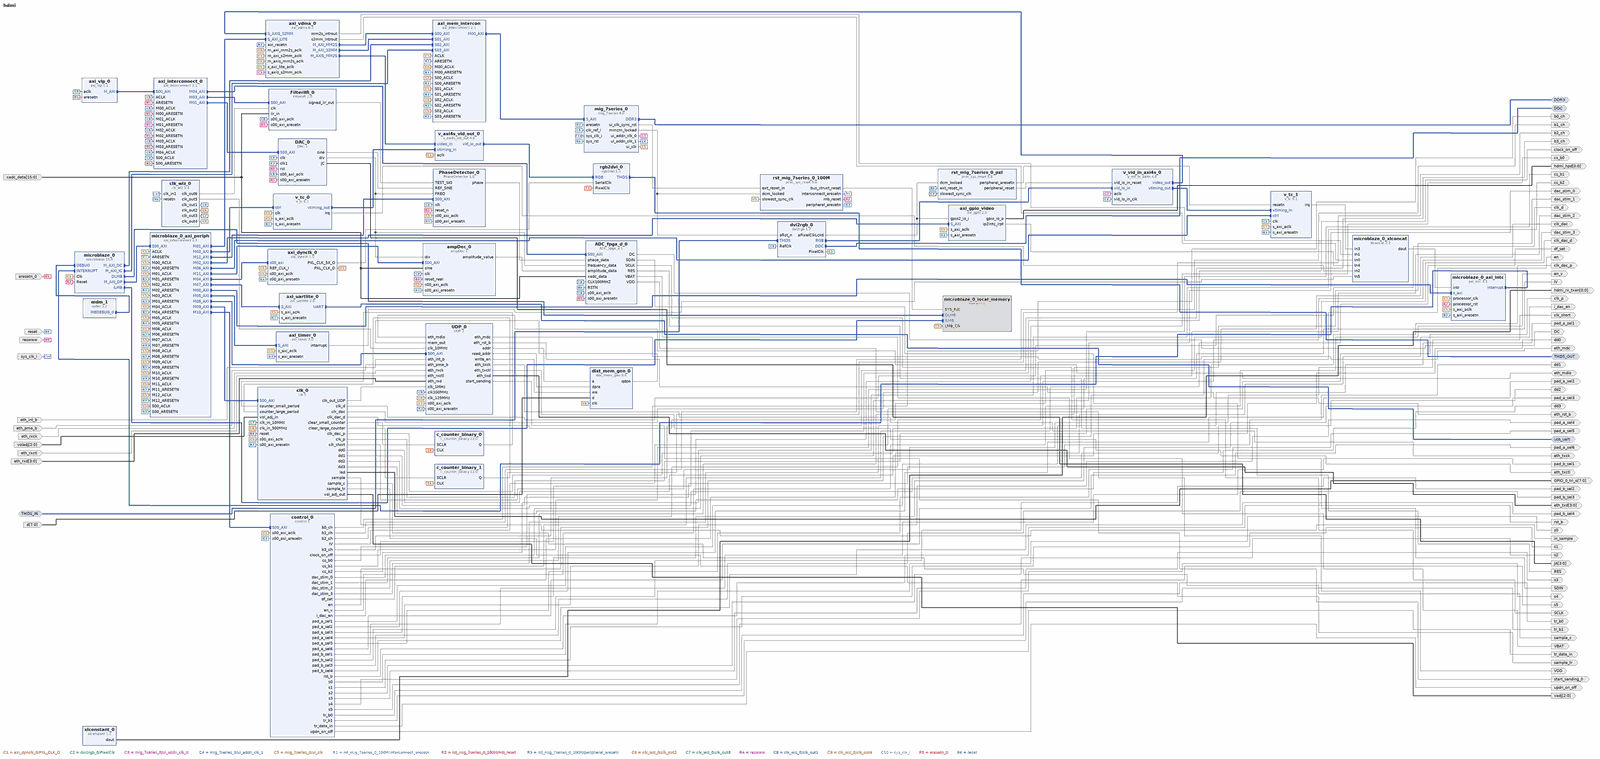
[diagram p0: block diagram of the top level, whole]
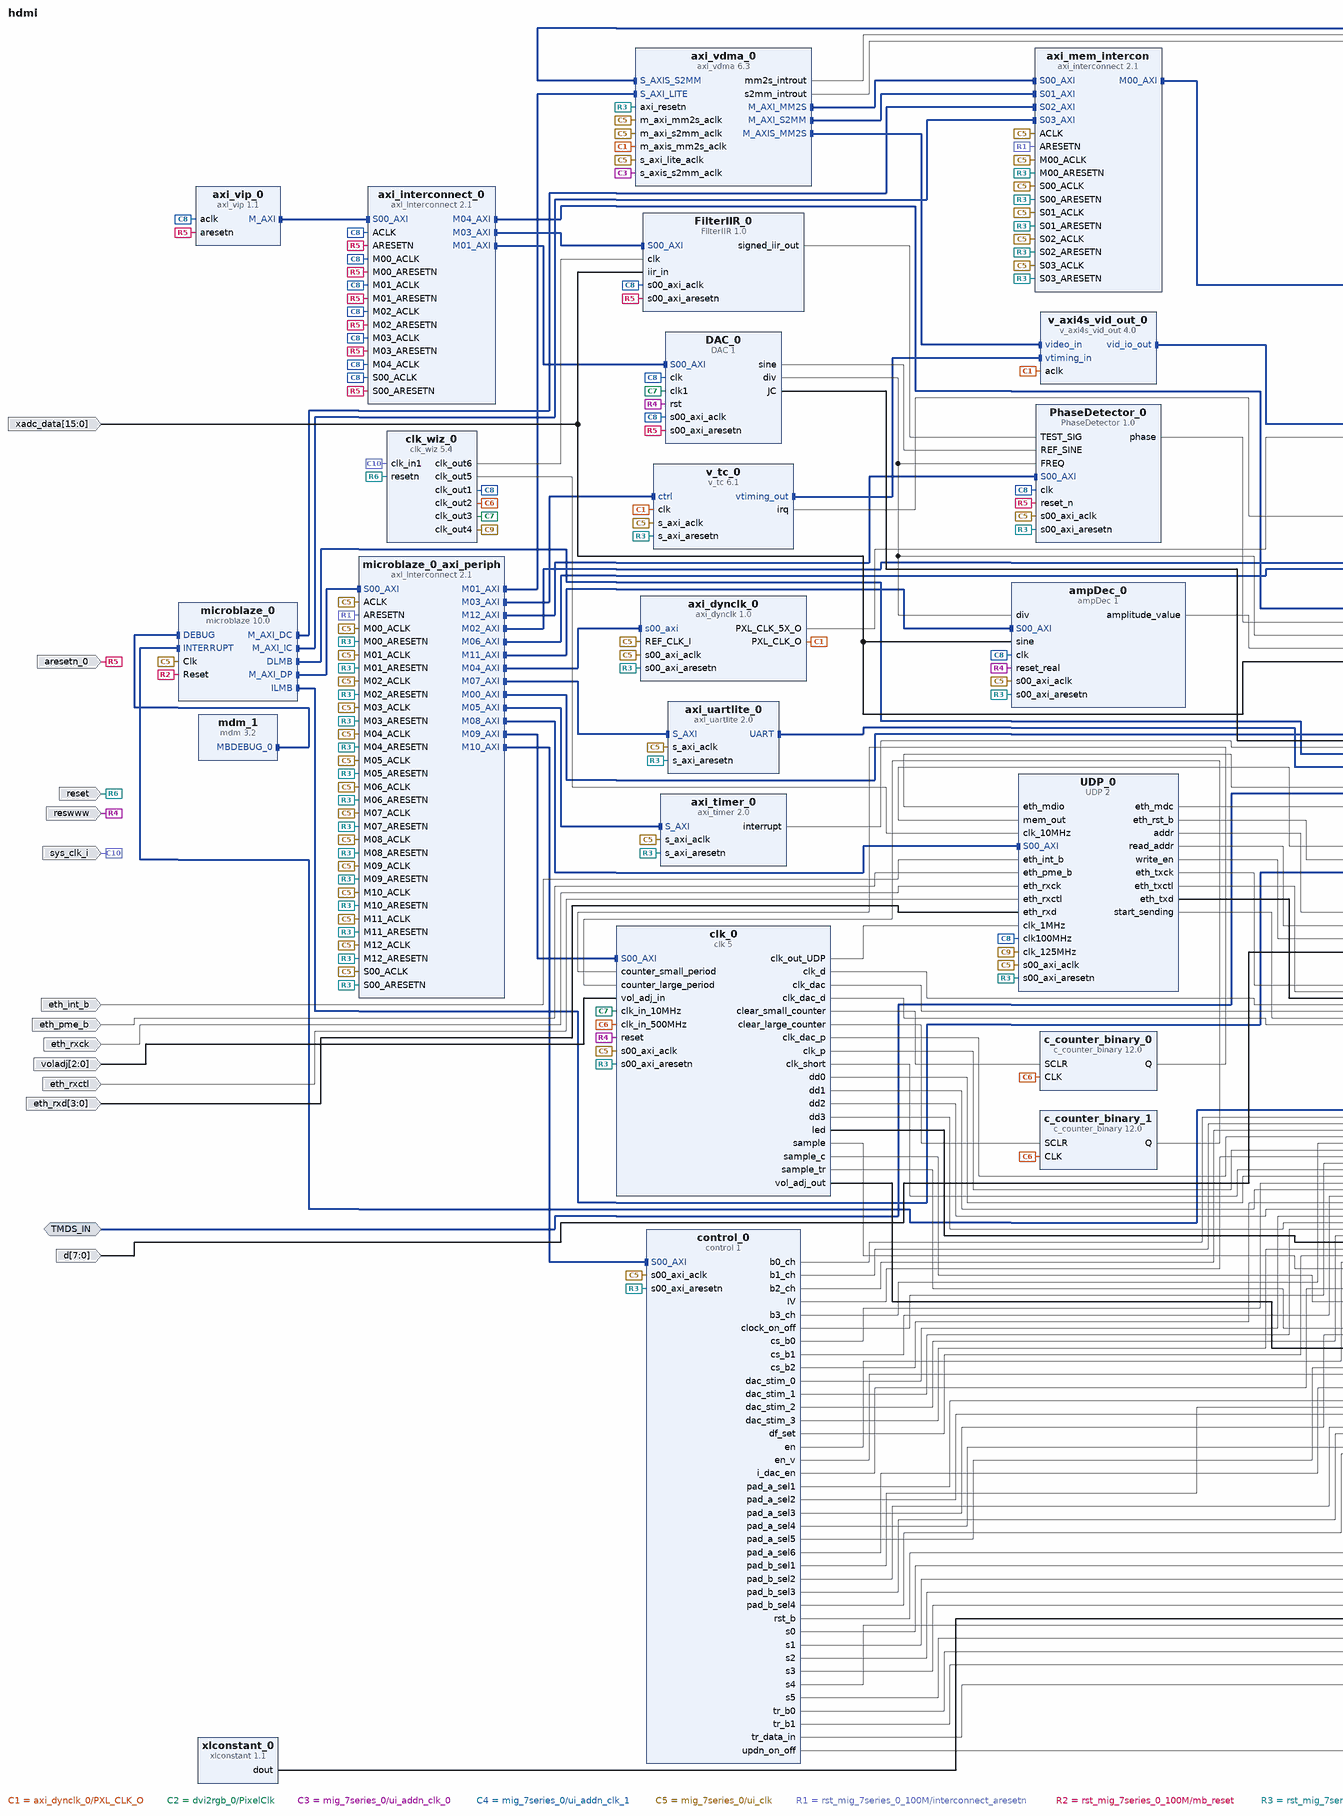
[diagram p1: block diagram of the top level, left part]
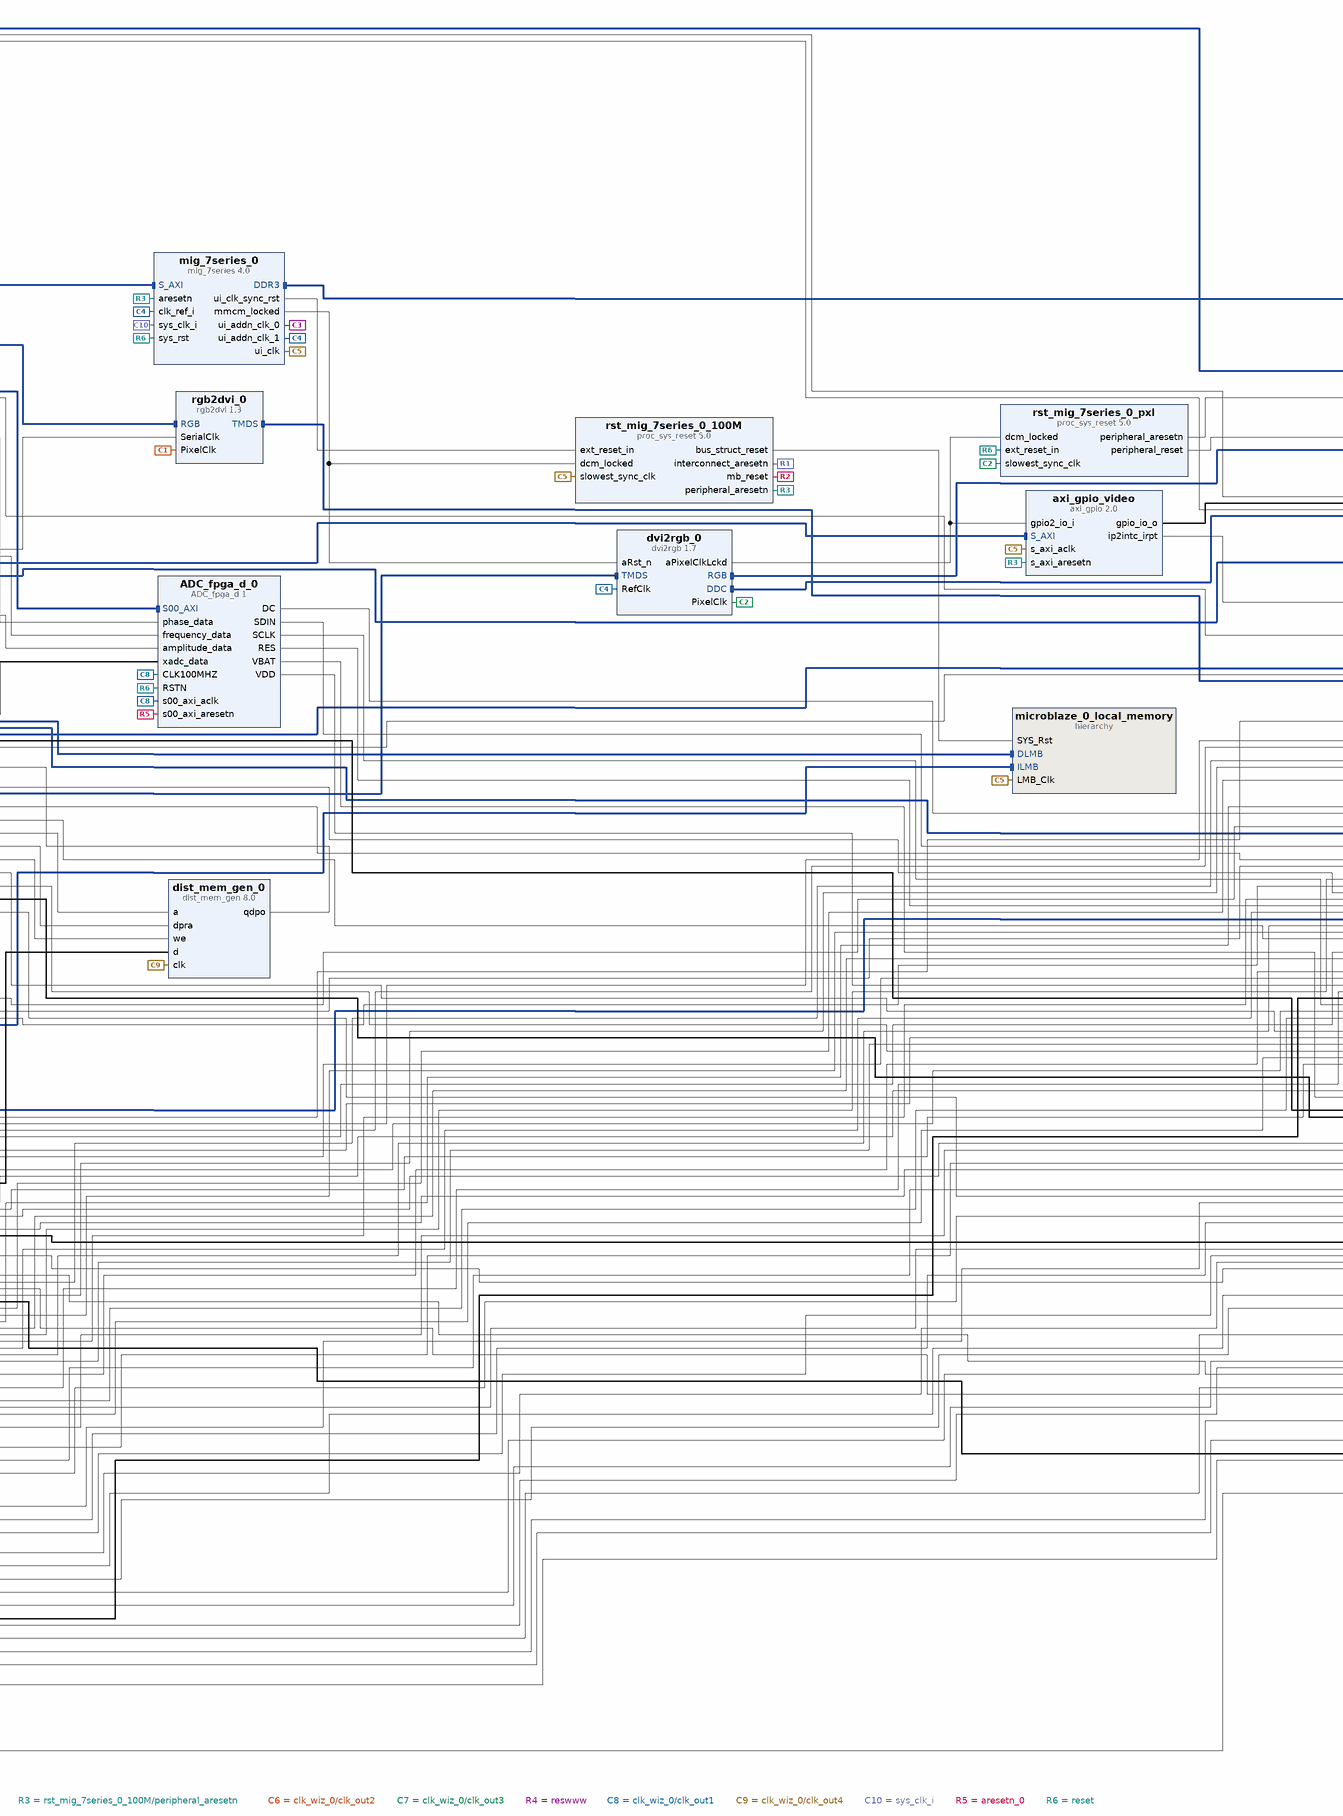
[diagram p2: block diagram of the top level, centre part]
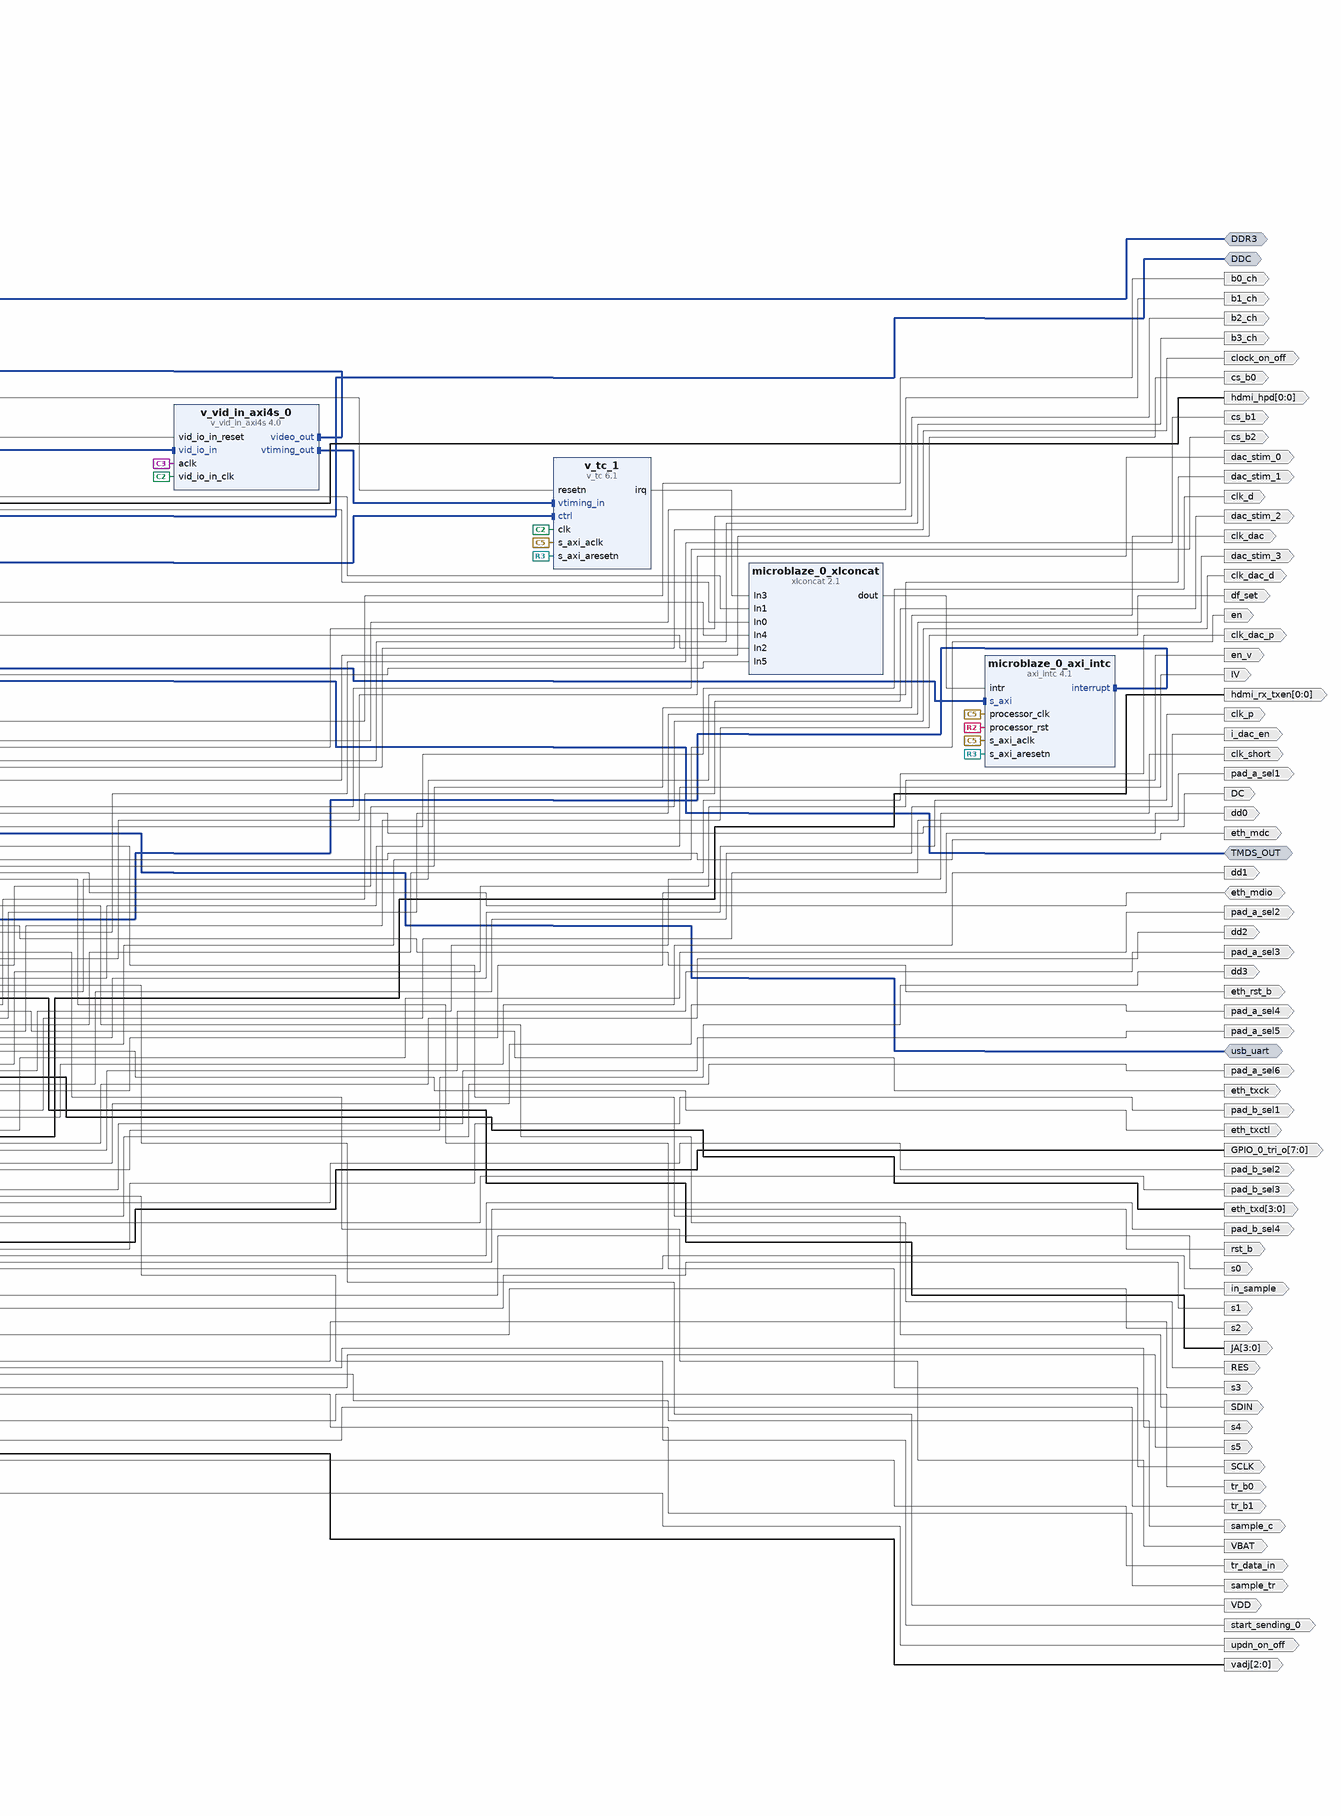
[diagram p3: block diagram of the top level, right part]
# Vivado block design hdmi, xc7a200tsbg484-1, Vivado 2017.4
create_bd_design hdmi

create_bd_intf_port -mode Master -vlnv xilinx.com:interface:iic_rtl:1.0 DDC
create_bd_intf_port -mode Master -vlnv xilinx.com:interface:ddrx_rtl:1.0 DDR3
create_bd_intf_port -mode Slave -vlnv digilentinc.com:interface:tmds_rtl:1.0 TMDS_IN
create_bd_intf_port -mode Master -vlnv digilentinc.com:interface:tmds_rtl:1.0 TMDS_OUT
create_bd_intf_port -mode Master -vlnv xilinx.com:interface:uart_rtl:1.0 usb_uart
create_bd_port -dir O -from 0 -to 0 hdmi_hpd
create_bd_port -dir O -from 0 -to 0 hdmi_rx_txen
create_bd_port -dir O IV
create_bd_port -dir O b0_ch
create_bd_port -dir O b1_ch
create_bd_port -dir O b2_ch
create_bd_port -dir O b3_ch
create_bd_port -dir O -type clk clock_on_off
create_bd_port -dir O cs_b0
create_bd_port -dir O cs_b1
create_bd_port -dir O cs_b2
create_bd_port -dir O dac_stim_0
create_bd_port -dir O dac_stim_1
create_bd_port -dir O dac_stim_2
create_bd_port -dir O dac_stim_3
create_bd_port -dir O df_set
create_bd_port -dir O en
create_bd_port -dir O en_v
create_bd_port -dir O i_dac_en
create_bd_port -dir O pad_a_sel1
create_bd_port -dir O pad_a_sel2
create_bd_port -dir O pad_a_sel3
create_bd_port -dir O pad_a_sel4
create_bd_port -dir O pad_a_sel5
create_bd_port -dir O pad_a_sel6
create_bd_port -dir O pad_b_sel1
create_bd_port -dir O pad_b_sel2
create_bd_port -dir O pad_b_sel3
create_bd_port -dir O pad_b_sel4
create_bd_port -dir O rst_b
create_bd_port -dir O s0
create_bd_port -dir O s1
create_bd_port -dir O s2
create_bd_port -dir O s3
create_bd_port -dir O s4
create_bd_port -dir O s5
create_bd_port -dir O tr_b0
create_bd_port -dir O tr_b1
create_bd_port -dir O tr_data_in
create_bd_port -dir O updn_on_off
create_bd_port -dir O clk_d
create_bd_port -dir O clk_dac
create_bd_port -dir O clk_dac_d
create_bd_port -dir O clk_dac_p
create_bd_port -dir O clk_p
create_bd_port -dir O clk_short
create_bd_port -dir O dd0
create_bd_port -dir O dd1
create_bd_port -dir O dd2
create_bd_port -dir O dd3
create_bd_port -dir O -from 7 -to 0 GPIO_0_tri_o
create_bd_port -dir I reswww
create_bd_port -dir O in_sample
create_bd_port -dir O sample_c
create_bd_port -dir O sample_tr
create_bd_port -dir I -from 2 -to 0 voladj
create_bd_port -dir O -from 2 -to 0 vadj
create_bd_port -dir I eth_int_b
create_bd_port -dir O eth_mdc
create_bd_port -dir IO eth_mdio
create_bd_port -dir I eth_pme_b
create_bd_port -dir O eth_rst_b
create_bd_port -dir I eth_rxck
create_bd_port -dir I eth_rxctl
create_bd_port -dir I -from 3 -to 0 eth_rxd
create_bd_port -dir O eth_txck
create_bd_port -dir O eth_txctl
create_bd_port -dir O -from 3 -to 0 eth_txd
create_bd_port -dir O start_sending_0
create_bd_port -dir I -from 7 -to 0 d
create_bd_port -dir O SDIN
create_bd_port -dir O SCLK
create_bd_port -dir O DC
create_bd_port -dir O RES
create_bd_port -dir O VBAT
create_bd_port -dir O VDD
create_bd_port -dir I -type clk sys_clk_i
set_property -dict {CONFIG.FREQ_HZ 200000000 CONFIG.PHASE 0.0 CONFIG.CLK_DOMAIN /clk_wiz_0_clk_out1} [get_bd_ports sys_clk_i]
create_bd_port -dir I -from 15 -to 0 xadc_data
create_bd_port -dir I -type rst aresetn_0
create_bd_port -dir I -type rst reset
set_property -dict {CONFIG.POLARITY ACTIVE_LOW} [get_bd_ports reset]
create_bd_port -dir O -from 3 -to 0 JA

create_bd_cell -type hier microblaze_0_local_memory
create_bd_cell -type ip -vlnv digilentinc.com:ip:axi_dynclk:1.0 axi_dynclk_0
set_property -dict {CONFIG.ADD_BUFMR true} [get_bd_cells axi_dynclk_0]
create_bd_cell -type ip -vlnv digilentinc.com:ip:dvi2rgb:1.7 dvi2rgb_0
set_property -dict {CONFIG.kRstActiveHigh false CONFIG.kClkRange 2 CONFIG.kAddBUFG false} [get_bd_cells dvi2rgb_0]
create_bd_cell -type ip -vlnv digilentinc.com:ip:rgb2dvi:1.3 rgb2dvi_0
set_property -dict {CONFIG.kRstActiveHigh false CONFIG.kGenerateSerialClk false CONFIG.kClkRange 2} [get_bd_cells rgb2dvi_0]
create_bd_cell -type ip -vlnv xilinx.com:ip:axi_gpio:2.0 axi_gpio_video
set_property -dict [list \
  CONFIG.C_GPIO_WIDTH 1 \
  CONFIG.C_GPIO2_WIDTH 1 \
  CONFIG.C_IS_DUAL 1 \
  CONFIG.C_ALL_INPUTS_2 1 \
  CONFIG.C_INTERRUPT_PRESENT 1 \
  CONFIG.USE_BOARD_FLOW true \
  CONFIG.GPIO_BOARD_INTERFACE Custom \
  CONFIG.C_ALL_OUTPUTS 1 \
] [get_bd_cells axi_gpio_video]
create_bd_cell -type ip -vlnv xilinx.com:ip:axi_interconnect:2.1 axi_mem_intercon
set_property -dict [list \
  CONFIG.NUM_SI 4 \
  CONFIG.NUM_MI 1 \
  CONFIG.SYNCHRONIZATION_STAGES 2 \
  CONFIG.M00_HAS_REGSLICE 4 \
  CONFIG.M00_HAS_DATA_FIFO 0 \
  CONFIG.S00_HAS_REGSLICE 4 \
  CONFIG.S01_HAS_REGSLICE 4 \
  CONFIG.S02_HAS_REGSLICE 4 \
  CONFIG.S03_HAS_REGSLICE 4 \
  CONFIG.S00_HAS_DATA_FIFO 0 \
  CONFIG.S01_HAS_DATA_FIFO 0 \
  CONFIG.S02_HAS_DATA_FIFO 0 \
  CONFIG.S03_HAS_DATA_FIFO 0 \
] [get_bd_cells axi_mem_intercon]
create_bd_cell -type ip -vlnv xilinx.com:ip:axi_timer:2.0 axi_timer_0
create_bd_cell -type ip -vlnv xilinx.com:ip:axi_uartlite:2.0 axi_uartlite_0
set_property -dict [list \
  CONFIG.C_BAUDRATE 115200 \
  CONFIG.USE_BOARD_FLOW true \
  CONFIG.UARTLITE_BOARD_INTERFACE usb_uart \
] [get_bd_cells axi_uartlite_0]
create_bd_cell -type ip -vlnv xilinx.com:ip:axi_vdma:6.3 axi_vdma_0
set_property -dict [list \
  CONFIG.c_m_axi_mm2s_data_width 128 \
  CONFIG.c_m_axis_mm2s_tdata_width 24 \
  CONFIG.c_m_axi_s2mm_data_width 128 \
  CONFIG.c_include_s2mm_dre 0 \
  CONFIG.c_use_mm2s_fsync 0 \
  CONFIG.c_use_s2mm_fsync 2 \
  CONFIG.c_mm2s_genlock_mode 0 \
  CONFIG.c_s2mm_genlock_mode 0 \
  CONFIG.c_mm2s_linebuffer_depth 4096 \
  CONFIG.c_s2mm_linebuffer_depth 4096 \
  CONFIG.c_mm2s_max_burst_length 32 \
  CONFIG.c_s2mm_max_burst_length 32 \
  CONFIG.c_include_s2mm 1 \
  CONFIG.c_addr_width 32 \
] [get_bd_cells axi_vdma_0]
create_bd_cell -type ip -vlnv xilinx.com:ip:mdm:3.2 mdm_1
create_bd_cell -type ip -vlnv xilinx.com:ip:microblaze:10.0 microblaze_0
set_property -dict [list \
  CONFIG.C_D_AXI 1 \
  CONFIG.C_D_LMB 1 \
  CONFIG.C_I_LMB 1 \
  CONFIG.C_ENABLE_DISCRETE_PORTS 0 \
  CONFIG.G_TEMPLATE_LIST 2 \
  CONFIG.G_USE_EXCEPTIONS 1 \
  CONFIG.C_USE_MSR_INSTR 1 \
  CONFIG.C_USE_PCMP_INSTR 1 \
  CONFIG.C_USE_REORDER_INSTR 1 \
  CONFIG.C_USE_BARREL 1 \
  CONFIG.C_USE_DIV 1 \
  CONFIG.C_USE_HW_MUL 2 \
  CONFIG.C_USE_FPU 2 \
  CONFIG.C_DEBUG_ENABLED 2 \
  CONFIG.C_DEBUG_COUNTER_WIDTH 32 \
  CONFIG.C_USE_ICACHE 1 \
  CONFIG.C_CACHE_BYTE_SIZE 32768 \
  CONFIG.C_ICACHE_LINE_LEN 8 \
  CONFIG.C_ICACHE_VICTIMS 8 \
  CONFIG.C_ICACHE_STREAMS 1 \
  CONFIG.C_ICACHE_DATA_WIDTH 1 \
  CONFIG.C_USE_DCACHE 1 \
  CONFIG.C_DCACHE_BYTE_SIZE 32768 \
  CONFIG.C_DCACHE_LINE_LEN 8 \
  CONFIG.C_DCACHE_USE_WRITEBACK 1 \
  CONFIG.C_DCACHE_VICTIMS 8 \
  CONFIG.C_DCACHE_DATA_WIDTH 1 \
  CONFIG.C_USE_BRANCH_TARGET_CACHE 0 \
] [get_bd_cells microblaze_0]
create_bd_cell -type ip -vlnv xilinx.com:ip:axi_intc:4.1 microblaze_0_axi_intc
set_property -dict {CONFIG.C_HAS_FAST 1} [get_bd_cells microblaze_0_axi_intc]
create_bd_cell -type ip -vlnv xilinx.com:ip:axi_interconnect:2.1 microblaze_0_axi_periph
set_property -dict {CONFIG.NUM_MI 13 CONFIG.SYNCHRONIZATION_STAGES 2} [get_bd_cells microblaze_0_axi_periph]
create_bd_cell -type ip -vlnv xilinx.com:ip:xlconcat:2.1 microblaze_0_xlconcat
set_property -dict {CONFIG.NUM_PORTS 6 CONFIG.dout_width 6} [get_bd_cells microblaze_0_xlconcat]
create_bd_cell -type ip -vlnv xilinx.com:ip:mig_7series:4.0 mig_7series_0
set_property -dict [list \
  CONFIG.XML_INPUT_FILE mig_b.prj \
  CONFIG.RESET_BOARD_INTERFACE reset \
  CONFIG.MIG_DONT_TOUCH_PARAM Custom \
  CONFIG.BOARD_MIG_PARAM Custom \
] [get_bd_cells mig_7series_0]
create_bd_cell -type ip -vlnv xilinx.com:ip:proc_sys_reset:5.0 rst_mig_7series_0_100M
create_bd_cell -type ip -vlnv xilinx.com:ip:proc_sys_reset:5.0 rst_mig_7series_0_pxl
set_property -dict {CONFIG.USE_BOARD_FLOW true CONFIG.RESET_BOARD_INTERFACE Custom} [get_bd_cells rst_mig_7series_0_pxl]
create_bd_cell -type ip -vlnv xilinx.com:ip:v_axi4s_vid_out:4.0 v_axi4s_vid_out_0
set_property -dict [list \
  CONFIG.C_S_AXIS_VIDEO_FORMAT 2 \
  CONFIG.C_S_AXIS_VIDEO_DATA_WIDTH 8 \
  CONFIG.C_ADDR_WIDTH 5 \
  CONFIG.C_VTG_MASTER_SLAVE 1 \
] [get_bd_cells v_axi4s_vid_out_0]
create_bd_cell -type ip -vlnv xilinx.com:ip:v_tc:6.1 v_tc_0
set_property -dict {CONFIG.enable_detection false} [get_bd_cells v_tc_0]
create_bd_cell -type ip -vlnv xilinx.com:ip:v_tc:6.1 v_tc_1
set_property -dict [list \
  CONFIG.HAS_INTC_IF true \
  CONFIG.max_lines_per_frame 2048 \
  CONFIG.horizontal_blank_detection false \
  CONFIG.enable_generation false \
  CONFIG.vertical_blank_detection false \
] [get_bd_cells v_tc_1]
create_bd_cell -type ip -vlnv xilinx.com:ip:v_vid_in_axi4s:4.0 v_vid_in_axi4s_0
set_property -dict {CONFIG.C_HAS_ASYNC_CLK 1 CONFIG.C_ADDR_WIDTH 5} [get_bd_cells v_vid_in_axi4s_0]
create_bd_cell -type ip -vlnv xilinx.com:ip:xlconstant:1.1 xlconstant_0
create_bd_cell -type ip -vlnv xilinx.com:user:UDP:2 UDP_0
create_bd_cell -type ip -vlnv xilinx.com:user:clk:5 clk_0
create_bd_cell -type ip -vlnv xilinx.com:ip:c_counter_binary:12.0 c_counter_binary_0
set_property -dict {CONFIG.Implementation DSP48 CONFIG.Output_Width 32 CONFIG.SCLR true} [get_bd_cells c_counter_binary_0]
create_bd_cell -type ip -vlnv xilinx.com:ip:c_counter_binary:12.0 c_counter_binary_1
set_property -dict {CONFIG.Implementation DSP48 CONFIG.Output_Width 32 CONFIG.SCLR true} [get_bd_cells c_counter_binary_1]
create_bd_cell -type ip -vlnv xilinx.com:ip:clk_wiz:5.4 clk_wiz_0
set_property -dict [list \
  CONFIG.CLKIN1_JITTER_PS 100.0 \
  CONFIG.CLKOUT2_USED true \
  CONFIG.CLKOUT3_USED true \
  CONFIG.CLKOUT4_USED true \
  CONFIG.CLKOUT5_USED true \
  CONFIG.CLKOUT6_USED true \
  CONFIG.NUM_OUT_CLKS 6 \
  CONFIG.CLKOUT2_REQUESTED_OUT_FREQ 500.000 \
  CONFIG.CLKOUT3_REQUESTED_OUT_FREQ 8.000 \
  CONFIG.CLKOUT4_REQUESTED_OUT_FREQ 125.000 \
  CONFIG.CLKOUT5_REQUESTED_OUT_FREQ 20.000 \
  CONFIG.USE_LOCKED false \
  CONFIG.RESET_PORT resetn \
  CONFIG.MMCM_DIVCLK_DIVIDE 1 \
  CONFIG.MMCM_CLKFBOUT_MULT_F 10.000 \
  CONFIG.MMCM_CLKIN1_PERIOD 10.000 \
  CONFIG.MMCM_CLKIN2_PERIOD 10.000 \
  CONFIG.MMCM_CLKOUT1_DIVIDE 2 \
  CONFIG.MMCM_CLKOUT2_DIVIDE 125 \
  CONFIG.MMCM_CLKOUT3_DIVIDE 8 \
  CONFIG.MMCM_CLKOUT4_DIVIDE 50 \
  CONFIG.MMCM_CLKOUT5_DIVIDE 10 \
  CONFIG.RESET_TYPE ACTIVE_LOW \
  CONFIG.CLK_IN1_BOARD_INTERFACE sys_clock \
  CONFIG.CLKOUT1_JITTER 130.958 \
  CONFIG.CLKOUT1_PHASE_ERROR 98.575 \
  CONFIG.CLKOUT2_JITTER 97.082 \
  CONFIG.CLKOUT2_PHASE_ERROR 98.575 \
  CONFIG.CLKOUT3_JITTER 218.754 \
  CONFIG.CLKOUT3_PHASE_ERROR 98.575 \
  CONFIG.CLKOUT4_JITTER 125.247 \
  CONFIG.CLKOUT4_PHASE_ERROR 98.575 \
  CONFIG.CLKOUT5_JITTER 183.243 \
  CONFIG.CLKOUT5_PHASE_ERROR 98.575 \
  CONFIG.CLKOUT6_JITTER 130.958 \
  CONFIG.CLKOUT6_PHASE_ERROR 98.575 \
] [get_bd_cells clk_wiz_0]
create_bd_cell -type ip -vlnv xilinx.com:user:control:1 control_0
create_bd_cell -type ip -vlnv xilinx.com:ip:dist_mem_gen:8.0 dist_mem_gen_0
set_property -dict [list \
  CONFIG.depth 2048 \
  CONFIG.data_width 8 \
  CONFIG.memory_type dual_port_ram \
  CONFIG.input_options registered \
  CONFIG.dual_port_address registered \
  CONFIG.output_options registered \
  CONFIG.Pipeline_Stages 1 \
  CONFIG.common_output_clk true \
] [get_bd_cells dist_mem_gen_0]
create_bd_cell -type ip -vlnv xilinx.com:ip:axi_vip:1.1 axi_vip_0
set_property -dict [list \
  CONFIG.PROTOCOL AXI4 \
  CONFIG.READ_WRITE_MODE READ_WRITE \
  CONFIG.INTERFACE_MODE MASTER \
  CONFIG.ADDR_WIDTH 32 \
  CONFIG.DATA_WIDTH 32 \
  CONFIG.ID_WIDTH 0 \
  CONFIG.AWUSER_WIDTH 0 \
  CONFIG.ARUSER_WIDTH 0 \
  CONFIG.RUSER_WIDTH 0 \
  CONFIG.WUSER_WIDTH 0 \
  CONFIG.BUSER_WIDTH 0 \
  CONFIG.WUSER_BITS_PER_BYTE 0 \
  CONFIG.RUSER_BITS_PER_BYTE 0 \
  CONFIG.SUPPORTS_NARROW 1 \
  CONFIG.HAS_BURST 1 \
  CONFIG.HAS_LOCK 1 \
  CONFIG.HAS_CACHE 1 \
  CONFIG.HAS_REGION 1 \
  CONFIG.HAS_QOS 1 \
  CONFIG.HAS_PROT 1 \
  CONFIG.HAS_WSTRB 1 \
  CONFIG.HAS_BRESP 1 \
  CONFIG.HAS_RRESP 1 \
] [get_bd_cells axi_vip_0]
create_bd_cell -type ip -vlnv xilinx.com:ip:axi_interconnect:2.1 axi_interconnect_0
set_property -dict {CONFIG.NUM_MI 5} [get_bd_cells axi_interconnect_0]
create_bd_cell -type ip -vlnv xilinx.com:user:ADC_fpga_d:1 ADC_fpga_d_0
create_bd_cell -type ip -vlnv xilinx.com:user:ampDec:1 ampDec_0
create_bd_cell -type ip -vlnv xilinx.com:user:PhaseDetector:1.0 PhaseDetector_0
create_bd_cell -type ip -vlnv xilinx.com:user:FilterIIR:1.0 FilterIIR_0
create_bd_cell -type ip -vlnv xilinx.com:user:DAC:1 DAC_0

# ---- hierarchy /microblaze_0_local_memory ----
current_bd_instance /microblaze_0_local_memory
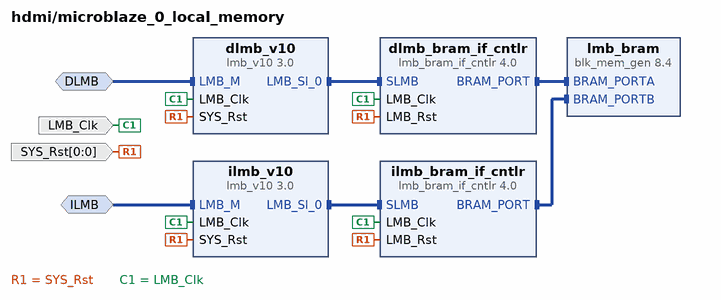
[diagram p4: block diagram inside /microblaze_0_local_memory]
create_bd_intf_pin -mode MirroredMaster -vlnv xilinx.com:interface:lmb_rtl:1.0 DLMB
create_bd_intf_pin -mode MirroredMaster -vlnv xilinx.com:interface:lmb_rtl:1.0 ILMB
create_bd_pin -dir I -type clk LMB_Clk
create_bd_pin -dir I -from 0 -to 0 -type rst SYS_Rst

create_bd_cell -type ip -vlnv xilinx.com:ip:lmb_v10:3.0 dlmb_v10
create_bd_cell -type ip -vlnv xilinx.com:ip:lmb_v10:3.0 ilmb_v10
create_bd_cell -type ip -vlnv xilinx.com:ip:lmb_bram_if_cntlr:4.0 dlmb_bram_if_cntlr
set_property -dict {CONFIG.C_ECC 0} [get_bd_cells dlmb_bram_if_cntlr]
create_bd_cell -type ip -vlnv xilinx.com:ip:lmb_bram_if_cntlr:4.0 ilmb_bram_if_cntlr
set_property -dict {CONFIG.C_ECC 0} [get_bd_cells ilmb_bram_if_cntlr]
create_bd_cell -type ip -vlnv xilinx.com:ip:blk_mem_gen:8.4 lmb_bram
set_property -dict [list \
  CONFIG.Memory_Type True_Dual_Port_RAM \
  CONFIG.Enable_B Use_ENB_Pin \
  CONFIG.Use_RSTB_Pin true \
  CONFIG.Port_B_Clock 100 \
  CONFIG.Port_B_Write_Rate 50 \
  CONFIG.Port_B_Enable_Rate 100 \
  CONFIG.use_bram_block BRAM_Controller \
  CONFIG.EN_SAFETY_CKT false \
] [get_bd_cells lmb_bram]

# ---- connections ----

current_bd_instance /microblaze_0_local_memory
connect_bd_intf_net -intf_net microblaze_0_dlmb_bus [get_bd_intf_pins dlmb_bram_if_cntlr/SLMB] [get_bd_intf_pins dlmb_v10/LMB_Sl_0]
connect_bd_intf_net -intf_net microblaze_0_dlmb_cntlr [get_bd_intf_pins dlmb_bram_if_cntlr/BRAM_PORT] [get_bd_intf_pins lmb_bram/BRAM_PORTA]
connect_bd_intf_net -intf_net microblaze_0_ilmb_bus [get_bd_intf_pins ilmb_bram_if_cntlr/SLMB] [get_bd_intf_pins ilmb_v10/LMB_Sl_0]
connect_bd_intf_net -intf_net microblaze_0_ilmb_cntlr [get_bd_intf_pins ilmb_bram_if_cntlr/BRAM_PORT] [get_bd_intf_pins lmb_bram/BRAM_PORTB]
connect_bd_intf_net -intf_net microblaze_0_dlmb [get_bd_intf_pins DLMB] [get_bd_intf_pins dlmb_v10/LMB_M]
connect_bd_intf_net -intf_net microblaze_0_ilmb [get_bd_intf_pins ILMB] [get_bd_intf_pins ilmb_v10/LMB_M]
connect_bd_net [get_bd_pins SYS_Rst] \
  [get_bd_pins dlmb_v10/SYS_Rst] [get_bd_pins ilmb_v10/SYS_Rst] [get_bd_pins dlmb_bram_if_cntlr/LMB_Rst] \
  [get_bd_pins ilmb_bram_if_cntlr/LMB_Rst]
connect_bd_net -net microblaze_0_Clk [get_bd_pins LMB_Clk] \
  [get_bd_pins dlmb_v10/LMB_Clk] [get_bd_pins ilmb_v10/LMB_Clk] [get_bd_pins dlmb_bram_if_cntlr/LMB_Clk] \
  [get_bd_pins ilmb_bram_if_cntlr/LMB_Clk]

current_bd_instance /
connect_bd_intf_net [get_bd_intf_pins axi_mem_intercon/M00_AXI] [get_bd_intf_pins mig_7series_0/S_AXI]
connect_bd_intf_net [get_bd_intf_pins axi_vdma_0/M_AXIS_MM2S] [get_bd_intf_pins v_axi4s_vid_out_0/video_in]
connect_bd_intf_net [get_bd_intf_pins axi_mem_intercon/S00_AXI] [get_bd_intf_pins axi_vdma_0/M_AXI_MM2S]
connect_bd_intf_net [get_bd_intf_pins axi_mem_intercon/S01_AXI] [get_bd_intf_pins axi_vdma_0/M_AXI_S2MM]
connect_bd_intf_net [get_bd_intf_pins dvi2rgb_0/RGB] [get_bd_intf_pins v_vid_in_axi4s_0/vid_io_in]
connect_bd_intf_net [get_bd_intf_pins axi_mem_intercon/S02_AXI] [get_bd_intf_pins microblaze_0/M_AXI_DC]
connect_bd_intf_net [get_bd_intf_pins axi_mem_intercon/S03_AXI] [get_bd_intf_pins microblaze_0/M_AXI_IC]
connect_bd_intf_net -intf_net microblaze_0_axi_dp [get_bd_intf_pins microblaze_0/M_AXI_DP] [get_bd_intf_pins microblaze_0_axi_periph/S00_AXI]
connect_bd_intf_net [get_bd_intf_pins axi_vdma_0/S_AXI_LITE] [get_bd_intf_pins microblaze_0_axi_periph/M01_AXI]
connect_bd_intf_net [get_bd_intf_pins axi_gpio_video/S_AXI] [get_bd_intf_pins microblaze_0_axi_periph/M02_AXI]
connect_bd_intf_net [get_bd_intf_pins microblaze_0_axi_periph/M03_AXI] [get_bd_intf_pins v_tc_0/ctrl]
connect_bd_intf_net [get_bd_intf_pins axi_dynclk_0/s00_axi] [get_bd_intf_pins microblaze_0_axi_periph/M04_AXI]
connect_bd_intf_net [get_bd_intf_pins axi_timer_0/S_AXI] [get_bd_intf_pins microblaze_0_axi_periph/M05_AXI]
connect_bd_intf_net [get_bd_intf_pins microblaze_0_axi_periph/M06_AXI] [get_bd_intf_pins v_tc_1/ctrl]
connect_bd_intf_net [get_bd_intf_pins axi_uartlite_0/S_AXI] [get_bd_intf_pins microblaze_0_axi_periph/M07_AXI]
connect_bd_intf_net [get_bd_intf_pins mdm_1/MBDEBUG_0] [get_bd_intf_pins microblaze_0/DEBUG]
connect_bd_intf_net [get_bd_intf_pins microblaze_0/DLMB] [get_bd_intf_pins microblaze_0_local_memory/DLMB]
connect_bd_intf_net [get_bd_intf_pins microblaze_0/ILMB] [get_bd_intf_pins microblaze_0_local_memory/ILMB]
connect_bd_intf_net -intf_net microblaze_0_intc_axi [get_bd_intf_pins microblaze_0_axi_intc/s_axi] [get_bd_intf_pins microblaze_0_axi_periph/M00_AXI]
connect_bd_intf_net [get_bd_intf_pins microblaze_0/INTERRUPT] [get_bd_intf_pins microblaze_0_axi_intc/interrupt]
connect_bd_intf_net [get_bd_intf_pins rgb2dvi_0/RGB] [get_bd_intf_pins v_axi4s_vid_out_0/vid_io_out]
connect_bd_intf_net [get_bd_intf_pins v_axi4s_vid_out_0/vtiming_in] [get_bd_intf_pins v_tc_0/vtiming_out]
connect_bd_intf_net [get_bd_intf_pins axi_vdma_0/S_AXIS_S2MM] [get_bd_intf_pins v_vid_in_axi4s_0/video_out]
connect_bd_intf_net [get_bd_intf_pins v_tc_1/vtiming_in] [get_bd_intf_pins v_vid_in_axi4s_0/vtiming_out]
connect_bd_intf_net [get_bd_intf_pins microblaze_0_axi_periph/M08_AXI] [get_bd_intf_pins UDP_0/S00_AXI]
connect_bd_intf_net [get_bd_intf_pins microblaze_0_axi_periph/M09_AXI] [get_bd_intf_pins clk_0/S00_AXI]
connect_bd_intf_net [get_bd_intf_pins microblaze_0_axi_periph/M10_AXI] [get_bd_intf_pins control_0/S00_AXI]
connect_bd_intf_net [get_bd_intf_pins axi_interconnect_0/S00_AXI] [get_bd_intf_pins axi_vip_0/M_AXI]
connect_bd_intf_net [get_bd_intf_pins axi_interconnect_0/M01_AXI] [get_bd_intf_pins DAC_0/S00_AXI]
connect_bd_intf_net [get_bd_intf_pins axi_interconnect_0/M03_AXI] [get_bd_intf_pins FilterIIR_0/S00_AXI]
connect_bd_intf_net [get_bd_intf_pins axi_interconnect_0/M04_AXI] [get_bd_intf_pins ADC_fpga_d_0/S00_AXI]
connect_bd_intf_net [get_bd_intf_pins microblaze_0_axi_periph/M11_AXI] [get_bd_intf_pins ampDec_0/S00_AXI]
connect_bd_intf_net [get_bd_intf_pins microblaze_0_axi_periph/M12_AXI] [get_bd_intf_pins PhaseDetector_0/S00_AXI]
connect_bd_intf_net [get_bd_intf_ports DDC] [get_bd_intf_pins dvi2rgb_0/DDC]
connect_bd_intf_net [get_bd_intf_ports DDR3] [get_bd_intf_pins mig_7series_0/DDR3]
connect_bd_intf_net [get_bd_intf_ports TMDS_IN] [get_bd_intf_pins dvi2rgb_0/TMDS]
connect_bd_intf_net [get_bd_intf_ports TMDS_OUT] [get_bd_intf_pins rgb2dvi_0/TMDS]
connect_bd_intf_net [get_bd_intf_ports usb_uart] [get_bd_intf_pins axi_uartlite_0/UART]
connect_bd_net -net SYS_Rst_1 [get_bd_pins rst_mig_7series_0_100M/bus_struct_reset] [get_bd_pins microblaze_0_local_memory/SYS_Rst]
connect_bd_net [get_bd_pins axi_dynclk_0/PXL_CLK_5X_O] [get_bd_pins rgb2dvi_0/SerialClk]
connect_bd_net [get_bd_pins axi_dynclk_0/PXL_CLK_O] \
  [get_bd_pins rgb2dvi_0/PixelClk] [get_bd_pins axi_vdma_0/m_axis_mm2s_aclk] [get_bd_pins v_axi4s_vid_out_0/aclk] \
  [get_bd_pins v_tc_0/clk]
connect_bd_net [get_bd_pins axi_gpio_video/gpio_io_o] [get_bd_ports hdmi_hpd]
connect_bd_net [get_bd_pins axi_gpio_video/ip2intc_irpt] [get_bd_pins microblaze_0_xlconcat/In4]
connect_bd_net [get_bd_pins axi_timer_0/interrupt] [get_bd_pins microblaze_0_xlconcat/In5]
connect_bd_net [get_bd_pins axi_vdma_0/mm2s_introut] [get_bd_pins microblaze_0_xlconcat/In1]
connect_bd_net [get_bd_pins axi_vdma_0/s2mm_introut] [get_bd_pins microblaze_0_xlconcat/In0]
connect_bd_net [get_bd_pins dvi2rgb_0/PixelClk] \
  [get_bd_pins rst_mig_7series_0_pxl/slowest_sync_clk] [get_bd_pins v_tc_1/clk] [get_bd_pins v_vid_in_axi4s_0/vid_io_in_clk]
connect_bd_net [get_bd_pins dvi2rgb_0/aPixelClkLckd] [get_bd_pins axi_gpio_video/gpio2_io_i] [get_bd_pins rst_mig_7series_0_pxl/dcm_locked]
connect_bd_net -net microblaze_0_intr [get_bd_pins microblaze_0_xlconcat/dout] [get_bd_pins microblaze_0_axi_intc/intr]
connect_bd_net [get_bd_pins mig_7series_0/mmcm_locked] [get_bd_pins dvi2rgb_0/aRst_n] [get_bd_pins rst_mig_7series_0_100M/dcm_locked]
connect_bd_net [get_bd_pins mig_7series_0/ui_addn_clk_0] [get_bd_pins axi_vdma_0/s_axis_s2mm_aclk] [get_bd_pins v_vid_in_axi4s_0/aclk]
connect_bd_net [get_bd_pins mig_7series_0/ui_addn_clk_1] [get_bd_pins dvi2rgb_0/RefClk] [get_bd_pins mig_7series_0/clk_ref_i]
connect_bd_net [get_bd_pins mig_7series_0/ui_clk] \
  [get_bd_pins axi_dynclk_0/REF_CLK_I] [get_bd_pins axi_dynclk_0/s00_axi_aclk] [get_bd_pins axi_gpio_video/s_axi_aclk] \
  [get_bd_pins axi_timer_0/s_axi_aclk] [get_bd_pins axi_uartlite_0/s_axi_aclk] [get_bd_pins axi_vdma_0/s_axi_lite_aclk] \
  [get_bd_pins axi_vdma_0/m_axi_mm2s_aclk] [get_bd_pins axi_vdma_0/m_axi_s2mm_aclk] [get_bd_pins microblaze_0/Clk] \
  [get_bd_pins microblaze_0_axi_intc/s_axi_aclk] [get_bd_pins microblaze_0_axi_intc/processor_clk] \
  [get_bd_pins rst_mig_7series_0_100M/slowest_sync_clk] [get_bd_pins v_tc_0/s_axi_aclk] [get_bd_pins v_tc_1/s_axi_aclk] \
  [get_bd_pins UDP_0/s00_axi_aclk] [get_bd_pins clk_0/s00_axi_aclk] [get_bd_pins control_0/s00_axi_aclk] \
  [get_bd_pins microblaze_0_local_memory/LMB_Clk] [get_bd_pins axi_mem_intercon/ACLK] [get_bd_pins axi_mem_intercon/S00_ACLK] \
  [get_bd_pins axi_mem_intercon/S01_ACLK] [get_bd_pins axi_mem_intercon/S02_ACLK] [get_bd_pins axi_mem_intercon/S03_ACLK] \
  [get_bd_pins axi_mem_intercon/M00_ACLK] [get_bd_pins microblaze_0_axi_periph/ACLK] \
  [get_bd_pins microblaze_0_axi_periph/S00_ACLK] [get_bd_pins microblaze_0_axi_periph/M00_ACLK] \
  [get_bd_pins microblaze_0_axi_periph/M01_ACLK] [get_bd_pins microblaze_0_axi_periph/M02_ACLK] \
  [get_bd_pins microblaze_0_axi_periph/M03_ACLK] [get_bd_pins microblaze_0_axi_periph/M04_ACLK] \
  [get_bd_pins microblaze_0_axi_periph/M05_ACLK] [get_bd_pins microblaze_0_axi_periph/M06_ACLK] \
  [get_bd_pins microblaze_0_axi_periph/M07_ACLK] [get_bd_pins microblaze_0_axi_periph/M08_ACLK] \
  [get_bd_pins microblaze_0_axi_periph/M09_ACLK] [get_bd_pins microblaze_0_axi_periph/M10_ACLK] \
  [get_bd_pins microblaze_0_axi_periph/M11_ACLK] [get_bd_pins ampDec_0/s00_axi_aclk] \
  [get_bd_pins PhaseDetector_0/s00_axi_aclk] [get_bd_pins microblaze_0_axi_periph/M12_ACLK]
connect_bd_net [get_bd_pins mig_7series_0/ui_clk_sync_rst] [get_bd_pins rst_mig_7series_0_100M/ext_reset_in]
connect_bd_net [get_bd_pins rst_mig_7series_0_100M/interconnect_aresetn] \
  [get_bd_pins axi_mem_intercon/ARESETN] [get_bd_pins microblaze_0_axi_periph/ARESETN]
connect_bd_net [get_bd_pins rst_mig_7series_0_100M/mb_reset] [get_bd_pins microblaze_0/Reset] [get_bd_pins microblaze_0_axi_intc/processor_rst]
connect_bd_net [get_bd_pins rst_mig_7series_0_100M/peripheral_aresetn] \
  [get_bd_pins axi_dynclk_0/s00_axi_aresetn] [get_bd_pins axi_gpio_video/s_axi_aresetn] \
  [get_bd_pins axi_timer_0/s_axi_aresetn] [get_bd_pins axi_uartlite_0/s_axi_aresetn] [get_bd_pins axi_vdma_0/axi_resetn] \
  [get_bd_pins microblaze_0_axi_intc/s_axi_aresetn] [get_bd_pins mig_7series_0/aresetn] [get_bd_pins v_tc_0/s_axi_aresetn] \
  [get_bd_pins v_tc_1/s_axi_aresetn] [get_bd_pins UDP_0/s00_axi_aresetn] [get_bd_pins clk_0/s00_axi_aresetn] \
  [get_bd_pins control_0/s00_axi_aresetn] [get_bd_pins axi_mem_intercon/S00_ARESETN] \
  [get_bd_pins axi_mem_intercon/S01_ARESETN] [get_bd_pins axi_mem_intercon/S02_ARESETN] \
  [get_bd_pins axi_mem_intercon/S03_ARESETN] [get_bd_pins axi_mem_intercon/M00_ARESETN] \
  [get_bd_pins microblaze_0_axi_periph/S00_ARESETN] [get_bd_pins microblaze_0_axi_periph/M00_ARESETN] \
  [get_bd_pins microblaze_0_axi_periph/M01_ARESETN] [get_bd_pins microblaze_0_axi_periph/M02_ARESETN] \
  [get_bd_pins microblaze_0_axi_periph/M03_ARESETN] [get_bd_pins microblaze_0_axi_periph/M04_ARESETN] \
  [get_bd_pins microblaze_0_axi_periph/M05_ARESETN] [get_bd_pins microblaze_0_axi_periph/M06_ARESETN] \
  [get_bd_pins microblaze_0_axi_periph/M07_ARESETN] [get_bd_pins microblaze_0_axi_periph/M08_ARESETN] \
  [get_bd_pins microblaze_0_axi_periph/M09_ARESETN] [get_bd_pins microblaze_0_axi_periph/M10_ARESETN] \
  [get_bd_pins microblaze_0_axi_periph/M11_ARESETN] [get_bd_pins ampDec_0/s00_axi_aresetn] \
  [get_bd_pins PhaseDetector_0/s00_axi_aresetn] [get_bd_pins microblaze_0_axi_periph/M12_ARESETN]
connect_bd_net [get_bd_pins rst_mig_7series_0_pxl/peripheral_aresetn] [get_bd_pins v_tc_1/resetn]
connect_bd_net [get_bd_pins rst_mig_7series_0_pxl/peripheral_reset] [get_bd_pins v_vid_in_axi4s_0/vid_io_in_reset]
connect_bd_net [get_bd_pins v_tc_0/irq] [get_bd_pins microblaze_0_xlconcat/In2]
connect_bd_net [get_bd_pins v_tc_1/irq] [get_bd_pins microblaze_0_xlconcat/In3]
connect_bd_net [get_bd_pins xlconstant_0/dout] [get_bd_ports hdmi_rx_txen]
connect_bd_net [get_bd_pins clk_wiz_0/clk_out2] \
  [get_bd_pins c_counter_binary_0/CLK] [get_bd_pins c_counter_binary_1/CLK] [get_bd_pins clk_0/clk_in_500MHz]
connect_bd_net [get_bd_pins c_counter_binary_0/Q] [get_bd_pins clk_0/counter_small_period]
connect_bd_net [get_bd_pins c_counter_binary_1/Q] [get_bd_pins clk_0/counter_large_period]
connect_bd_net [get_bd_pins clk_0/clear_small_counter] [get_bd_pins c_counter_binary_0/SCLR]
connect_bd_net [get_bd_pins clk_0/clear_large_counter] [get_bd_pins c_counter_binary_1/SCLR]
connect_bd_net [get_bd_pins clk_wiz_0/clk_out3] [get_bd_pins clk_0/clk_in_10MHz] [get_bd_pins DAC_0/clk1]
connect_bd_net [get_bd_pins control_0/IV] [get_bd_ports IV]
connect_bd_net [get_bd_pins control_0/b0_ch] [get_bd_ports b0_ch]
connect_bd_net [get_bd_pins control_0/b1_ch] [get_bd_ports b1_ch]
connect_bd_net [get_bd_pins control_0/b2_ch] [get_bd_ports b2_ch]
connect_bd_net [get_bd_pins control_0/b3_ch] [get_bd_ports b3_ch]
connect_bd_net [get_bd_pins control_0/clock_on_off] [get_bd_ports clock_on_off]
connect_bd_net [get_bd_pins control_0/cs_b0] [get_bd_ports cs_b0]
connect_bd_net [get_bd_pins control_0/cs_b1] [get_bd_ports cs_b1]
connect_bd_net [get_bd_pins control_0/cs_b2] [get_bd_ports cs_b2]
connect_bd_net [get_bd_pins control_0/dac_stim_0] [get_bd_ports dac_stim_0]
connect_bd_net [get_bd_pins control_0/dac_stim_1] [get_bd_ports dac_stim_1]
connect_bd_net [get_bd_pins control_0/dac_stim_2] [get_bd_ports dac_stim_2]
connect_bd_net [get_bd_pins control_0/dac_stim_3] [get_bd_ports dac_stim_3]
connect_bd_net [get_bd_pins control_0/df_set] [get_bd_ports df_set]
connect_bd_net [get_bd_pins control_0/en] [get_bd_ports en]
connect_bd_net [get_bd_pins control_0/en_v] [get_bd_ports en_v]
connect_bd_net [get_bd_pins control_0/i_dac_en] [get_bd_ports i_dac_en]
connect_bd_net [get_bd_pins control_0/pad_a_sel1] [get_bd_ports pad_a_sel1]
connect_bd_net [get_bd_pins control_0/pad_a_sel2] [get_bd_ports pad_a_sel2]
connect_bd_net [get_bd_pins control_0/pad_a_sel3] [get_bd_ports pad_a_sel3]
connect_bd_net [get_bd_pins control_0/pad_a_sel4] [get_bd_ports pad_a_sel4]
connect_bd_net [get_bd_pins control_0/pad_a_sel5] [get_bd_ports pad_a_sel5]
connect_bd_net [get_bd_pins control_0/pad_a_sel6] [get_bd_ports pad_a_sel6]
connect_bd_net [get_bd_pins control_0/pad_b_sel1] [get_bd_ports pad_b_sel1]
connect_bd_net [get_bd_pins control_0/pad_b_sel2] [get_bd_ports pad_b_sel2]
connect_bd_net [get_bd_pins control_0/pad_b_sel3] [get_bd_ports pad_b_sel3]
connect_bd_net [get_bd_pins control_0/pad_b_sel4] [get_bd_ports pad_b_sel4]
connect_bd_net [get_bd_pins control_0/rst_b] [get_bd_ports rst_b]
connect_bd_net [get_bd_pins control_0/s0] [get_bd_ports s0]
connect_bd_net [get_bd_pins control_0/s1] [get_bd_ports s1]
connect_bd_net [get_bd_pins control_0/s2] [get_bd_ports s2]
connect_bd_net [get_bd_pins control_0/s3] [get_bd_ports s3]
connect_bd_net [get_bd_pins control_0/s4] [get_bd_ports s4]
connect_bd_net [get_bd_pins control_0/s5] [get_bd_ports s5]
connect_bd_net [get_bd_pins control_0/tr_b0] [get_bd_ports tr_b0]
connect_bd_net [get_bd_pins control_0/tr_b1] [get_bd_ports tr_b1]
connect_bd_net [get_bd_pins control_0/tr_data_in] [get_bd_ports tr_data_in]
connect_bd_net [get_bd_pins control_0/updn_on_off] [get_bd_ports updn_on_off]
connect_bd_net [get_bd_pins clk_0/clk_d] [get_bd_ports clk_d]
connect_bd_net [get_bd_pins clk_0/clk_dac] [get_bd_ports clk_dac]
connect_bd_net [get_bd_pins clk_0/clk_dac_d] [get_bd_ports clk_dac_d]
connect_bd_net [get_bd_pins clk_0/clk_dac_p] [get_bd_ports clk_dac_p]
connect_bd_net [get_bd_pins clk_0/clk_out_UDP] [get_bd_pins UDP_0/clk_1MHz]
connect_bd_net [get_bd_pins clk_0/clk_p] [get_bd_ports clk_p]
connect_bd_net [get_bd_pins clk_0/clk_short] [get_bd_ports clk_short]
connect_bd_net [get_bd_pins clk_0/dd0] [get_bd_ports dd0]
connect_bd_net [get_bd_pins clk_0/dd1] [get_bd_ports dd1]
connect_bd_net [get_bd_pins clk_0/dd2] [get_bd_ports dd2]
connect_bd_net [get_bd_pins clk_0/dd3] [get_bd_ports dd3]
connect_bd_net [get_bd_pins clk_0/led] [get_bd_ports GPIO_0_tri_o]
connect_bd_net -net reset_0_1 [get_bd_ports reswww] [get_bd_pins clk_0/reset] [get_bd_pins ampDec_0/reset_real] [get_bd_pins DAC_0/rst]
connect_bd_net [get_bd_pins clk_0/sample] [get_bd_ports in_sample]
connect_bd_net [get_bd_pins clk_0/sample_c] [get_bd_ports sample_c]
connect_bd_net [get_bd_pins clk_0/sample_tr] [get_bd_ports sample_tr]
connect_bd_net -net vol_adj_in_0_1 [get_bd_ports voladj] [get_bd_pins clk_0/vol_adj_in]
connect_bd_net [get_bd_pins clk_0/vol_adj_out] [get_bd_ports vadj]
connect_bd_net [get_bd_pins clk_wiz_0/clk_out5] [get_bd_pins UDP_0/clk_10MHz]
connect_bd_net [get_bd_pins clk_wiz_0/clk_out1] \
  [get_bd_pins UDP_0/clk100MHz] [get_bd_pins axi_vip_0/aclk] [get_bd_pins ADC_fpga_d_0/CLK100MHZ] \
  [get_bd_pins ADC_fpga_d_0/s00_axi_aclk] [get_bd_pins axi_interconnect_0/ACLK] [get_bd_pins axi_interconnect_0/S00_ACLK] \
  [get_bd_pins axi_interconnect_0/M00_ACLK] [get_bd_pins axi_interconnect_0/M01_ACLK] \
  [get_bd_pins axi_interconnect_0/M02_ACLK] [get_bd_pins axi_interconnect_0/M04_ACLK] \
  [get_bd_pins axi_interconnect_0/M03_ACLK] [get_bd_pins ampDec_0/clk] [get_bd_pins PhaseDetector_0/clk] \
  [get_bd_pins FilterIIR_0/s00_axi_aclk] [get_bd_pins DAC_0/clk] [get_bd_pins DAC_0/s00_axi_aclk]
connect_bd_net [get_bd_pins clk_wiz_0/clk_out4] [get_bd_pins UDP_0/clk_125MHz] [get_bd_pins dist_mem_gen_0/clk]
connect_bd_net [get_bd_pins dist_mem_gen_0/qdpo] [get_bd_pins UDP_0/mem_out]
connect_bd_net [get_bd_pins UDP_0/addr] [get_bd_pins dist_mem_gen_0/a]
connect_bd_net -net eth_int_b_0_1 [get_bd_ports eth_int_b] [get_bd_pins UDP_0/eth_int_b]
connect_bd_net [get_bd_pins UDP_0/eth_mdc] [get_bd_ports eth_mdc]
connect_bd_net [get_bd_ports eth_mdio] [get_bd_pins UDP_0/eth_mdio]
connect_bd_net -net eth_pme_b_0_1 [get_bd_ports eth_pme_b] [get_bd_pins UDP_0/eth_pme_b]
connect_bd_net [get_bd_pins UDP_0/eth_rst_b] [get_bd_ports eth_rst_b]
connect_bd_net -net eth_rxck_0_1 [get_bd_ports eth_rxck] [get_bd_pins UDP_0/eth_rxck]
connect_bd_net -net eth_rxctl_0_1 [get_bd_ports eth_rxctl] [get_bd_pins UDP_0/eth_rxctl]
connect_bd_net -net eth_rxd_0_1 [get_bd_ports eth_rxd] [get_bd_pins UDP_0/eth_rxd]
connect_bd_net [get_bd_pins UDP_0/eth_txck] [get_bd_ports eth_txck]
connect_bd_net [get_bd_pins UDP_0/eth_txctl] [get_bd_ports eth_txctl]
connect_bd_net [get_bd_pins UDP_0/eth_txd] [get_bd_ports eth_txd]
connect_bd_net [get_bd_pins UDP_0/read_addr] [get_bd_pins dist_mem_gen_0/dpra]
connect_bd_net [get_bd_pins UDP_0/start_sending] [get_bd_ports start_sending_0]
connect_bd_net [get_bd_pins UDP_0/write_en] [get_bd_pins dist_mem_gen_0/we]
connect_bd_net -net d_0_1 [get_bd_ports d] [get_bd_pins dist_mem_gen_0/d]
connect_bd_net [get_bd_pins ADC_fpga_d_0/SDIN] [get_bd_ports SDIN]
connect_bd_net [get_bd_pins ADC_fpga_d_0/SCLK] [get_bd_ports SCLK]
connect_bd_net [get_bd_pins ADC_fpga_d_0/DC] [get_bd_ports DC]
connect_bd_net [get_bd_pins ADC_fpga_d_0/RES] [get_bd_ports RES]
connect_bd_net [get_bd_pins ADC_fpga_d_0/VBAT] [get_bd_ports VBAT]
connect_bd_net [get_bd_pins ADC_fpga_d_0/VDD] [get_bd_ports VDD]
connect_bd_net [get_bd_ports sys_clk_i] [get_bd_pins clk_wiz_0/clk_in1] [get_bd_pins mig_7series_0/sys_clk_i]
connect_bd_net [get_bd_pins ampDec_0/amplitude_value] [get_bd_pins ADC_fpga_d_0/amplitude_data]
connect_bd_net [get_bd_pins DAC_0/div] [get_bd_pins ADC_fpga_d_0/frequency_data] [get_bd_pins ampDec_0/div] [get_bd_pins PhaseDetector_0/FREQ]
connect_bd_net [get_bd_ports xadc_data] [get_bd_pins ADC_fpga_d_0/xadc_data] [get_bd_pins FilterIIR_0/iir_in] [get_bd_pins ampDec_0/sine]
connect_bd_net [get_bd_pins DAC_0/sine] [get_bd_pins PhaseDetector_0/REF_SINE]
connect_bd_net [get_bd_pins PhaseDetector_0/phase] [get_bd_pins ADC_fpga_d_0/phase_data]
connect_bd_net -net aresetn_0_1 [get_bd_ports aresetn_0] \
  [get_bd_pins axi_vip_0/aresetn] [get_bd_pins ADC_fpga_d_0/s00_axi_aresetn] [get_bd_pins axi_interconnect_0/ARESETN] \
  [get_bd_pins axi_interconnect_0/S00_ARESETN] [get_bd_pins axi_interconnect_0/M00_ARESETN] \
  [get_bd_pins axi_interconnect_0/M01_ARESETN] [get_bd_pins axi_interconnect_0/M02_ARESETN] \
  [get_bd_pins axi_interconnect_0/M03_ARESETN] [get_bd_pins PhaseDetector_0/reset_n] \
  [get_bd_pins FilterIIR_0/s00_axi_aresetn] [get_bd_pins DAC_0/s00_axi_aresetn]
connect_bd_net [get_bd_ports reset] \
  [get_bd_pins mig_7series_0/sys_rst] [get_bd_pins rst_mig_7series_0_pxl/ext_reset_in] [get_bd_pins clk_wiz_0/resetn] \
  [get_bd_pins ADC_fpga_d_0/RSTN]
connect_bd_net [get_bd_pins DAC_0/JC] [get_bd_ports JA]
connect_bd_net [get_bd_pins FilterIIR_0/signed_iir_out] [get_bd_pins PhaseDetector_0/TEST_SIG]
connect_bd_net [get_bd_pins clk_wiz_0/clk_out6] [get_bd_pins FilterIIR_0/clk]

# ---- address map ----
assign_bd_address -offset 0x80000000 -range 512M -target_address_space [get_bd_addr_spaces axi_vdma_0/Data_MM2S] [get_bd_addr_segs mig_7series_0/memmap/memaddr]
assign_bd_address -offset 0x80000000 -range 512M -target_address_space [get_bd_addr_spaces axi_vdma_0/Data_S2MM] [get_bd_addr_segs mig_7series_0/memmap/memaddr]
assign_bd_address -offset 0x44A00000 -range 64K -target_address_space [get_bd_addr_spaces axi_vip_0/Master_AXI] [get_bd_addr_segs ADC_fpga_d_0/S00_AXI/S00_AXI_reg]
assign_bd_address -offset 0x44A10000 -range 64K -target_address_space [get_bd_addr_spaces axi_vip_0/Master_AXI] [get_bd_addr_segs DAC_0/S00_AXI/S00_AXI_reg]
assign_bd_address -offset 0x44A20000 -range 64K -target_address_space [get_bd_addr_spaces axi_vip_0/Master_AXI] [get_bd_addr_segs FilterIIR_0/S00_AXI/S00_AXI_reg]
assign_bd_address -offset 0x00000000 -range 32K -target_address_space [get_bd_addr_spaces microblaze_0/Data] [get_bd_addr_segs microblaze_0_local_memory/dlmb_bram_if_cntlr/SLMB/Mem]
assign_bd_address -offset 0x40000000 -range 64K -target_address_space [get_bd_addr_spaces microblaze_0/Data] [get_bd_addr_segs axi_gpio_video/S_AXI/Reg]
assign_bd_address -offset 0x40600000 -range 64K -target_address_space [get_bd_addr_spaces microblaze_0/Data] [get_bd_addr_segs axi_uartlite_0/S_AXI/Reg]
assign_bd_address -offset 0x41200000 -range 64K -target_address_space [get_bd_addr_spaces microblaze_0/Data] [get_bd_addr_segs microblaze_0_axi_intc/S_AXI/Reg]
assign_bd_address -offset 0x41C00000 -range 64K -target_address_space [get_bd_addr_spaces microblaze_0/Data] [get_bd_addr_segs axi_timer_0/S_AXI/Reg]
assign_bd_address -offset 0x44A00000 -range 64K -target_address_space [get_bd_addr_spaces microblaze_0/Data] [get_bd_addr_segs axi_vdma_0/S_AXI_LITE/Reg]
assign_bd_address -offset 0x44A10000 -range 64K -target_address_space [get_bd_addr_spaces microblaze_0/Data] [get_bd_addr_segs v_tc_0/ctrl/Reg]
assign_bd_address -offset 0x44A20000 -range 64K -target_address_space [get_bd_addr_spaces microblaze_0/Data] [get_bd_addr_segs axi_dynclk_0/s00_axi/reg0]
assign_bd_address -offset 0x44A30000 -range 64K -target_address_space [get_bd_addr_spaces microblaze_0/Data] [get_bd_addr_segs v_tc_1/ctrl/Reg]
assign_bd_address -offset 0x44A40000 -range 64K -target_address_space [get_bd_addr_spaces microblaze_0/Data] [get_bd_addr_segs UDP_0/S00_AXI/S00_AXI_reg]
assign_bd_address -offset 0x44A50000 -range 64K -target_address_space [get_bd_addr_spaces microblaze_0/Data] [get_bd_addr_segs clk_0/S00_AXI/S00_AXI_reg]
assign_bd_address -offset 0x44A60000 -range 64K -target_address_space [get_bd_addr_spaces microblaze_0/Data] [get_bd_addr_segs control_0/S00_AXI/S00_AXI_reg]
assign_bd_address -offset 0x44A70000 -range 64K -target_address_space [get_bd_addr_spaces microblaze_0/Data] [get_bd_addr_segs ampDec_0/S00_AXI/S00_AXI_reg]
assign_bd_address -offset 0x44A80000 -range 64K -target_address_space [get_bd_addr_spaces microblaze_0/Data] [get_bd_addr_segs PhaseDetector_0/S00_AXI/S00_AXI_reg]
assign_bd_address -offset 0x80000000 -range 512M -target_address_space [get_bd_addr_spaces microblaze_0/Data] [get_bd_addr_segs mig_7series_0/memmap/memaddr]
assign_bd_address -offset 0x00000000 -range 32K -target_address_space [get_bd_addr_spaces microblaze_0/Instruction] [get_bd_addr_segs microblaze_0_local_memory/ilmb_bram_if_cntlr/SLMB/Mem]
assign_bd_address -offset 0x80000000 -range 512M -target_address_space [get_bd_addr_spaces microblaze_0/Instruction] [get_bd_addr_segs mig_7series_0/memmap/memaddr]

validate_bd_design
save_bd_design
